# Altium schematic sheet 2UART.SchDoc
size A4
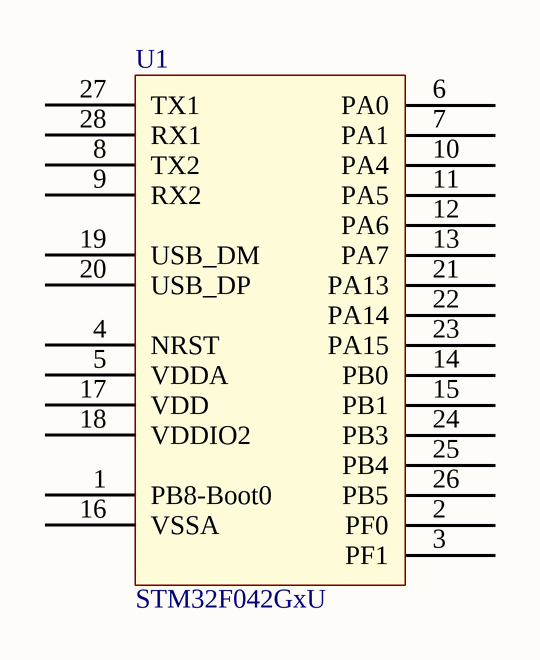
[diagram p0: 2UART.SchDoc]

## Parts
U1  STM32F042GxU  [UFQFPN28-4x4mm]

## Nets

Not connected (* = marked no-connect by the designer): U1 1(PB8-Boot0) 2(PF0) 3(PF1) 4(NRST) 5(VDDA) 6(PA0) 7(PA1) 8(TX2) 9(RX2) 10(PA4) 11(PA5) 12(PA6) 13(PA7) 14(PB0) 15(PB1) 16(VSSA) 17(VDD) 18(VDDIO2) 19(USB_DM) 20(USB_DP) 21(PA13) 22(PA14) 23(PA15) 24(PB3) 25(PB4) 26(PB5) 27(TX1) 28(RX1)

## Library data of the parts
U1 = STM32F042GxU: Imported; Vendor: STMicroelectronics; C: Copyright (C) 2016 Accelerated Designs. All rights reserved; Copyright: Copyright (C) 2016 Accelerated Designs. All rights reserved; Manufacturer_Part_Number: stm32f042gxu; Value: Value; Type: Type; RefDes: RefDes